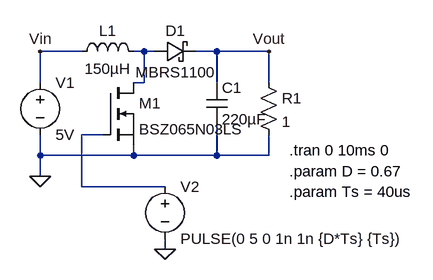
[diagram p0: schematic Boost_Converter.asc]
Boost_Converter.asc, the LTspice schematic file:
Version 4
SHEET 1 880 680
WIRE 176 48 112 48
WIRE 272 48 256 48
WIRE 288 48 272 48
WIRE 384 48 352 48
WIRE 464 48 384 48
WIRE 112 96 112 48
WIRE 272 96 272 48
WIRE 272 96 256 96
WIRE 384 96 384 48
WIRE 464 96 464 48
WIRE 208 176 176 176
WIRE 112 208 112 176
WIRE 256 208 256 192
WIRE 256 208 112 208
WIRE 384 208 384 160
WIRE 384 208 256 208
WIRE 464 208 464 176
WIRE 464 208 384 208
WIRE 112 240 112 208
WIRE 176 256 176 176
WIRE 304 256 176 256
WIRE 304 352 304 336
FLAG 112 240 0
FLAG 304 352 0
FLAG 112 48 Vin
FLAG 464 48 Vout
SYMBOL voltage 112 80 R0
WINDOW 123 0 0 Left 0
WINDOW 39 0 0 Left 0
SYMATTR InstName V1
SYMATTR Value 5V
SYMBOL ind 160 64 R270
WINDOW 0 32 56 VTop 2
WINDOW 3 5 56 VBottom 2
SYMATTR InstName L1
SYMATTR Value 150µH
SYMBOL schottky 288 64 R270
WINDOW 0 32 32 VTop 2
WINDOW 3 0 32 VBottom 2
SYMATTR InstName D1
SYMATTR Value MBRS1100
SYMATTR Description Diode
SYMATTR Type diode
SYMBOL cap 368 96 R0
SYMATTR InstName C1
SYMATTR Value 220µF
SYMBOL res 448 80 R0
SYMATTR InstName R1
SYMATTR Value 1
SYMBOL voltage 304 240 R0
WINDOW 123 0 0 Left 0
WINDOW 39 0 0 Left 0
SYMATTR InstName V2
SYMATTR Value PULSE(0 5 0 1n 1n {D*Ts} {Ts})
SYMBOL nmos 208 96 R0
SYMATTR InstName M1
SYMATTR Value BSZ065N03LS
TEXT 496 232 Left 2 !.param D = 0.67
TEXT 496 264 Left 2 !.param Ts = 40us
TEXT 496 200 Left 2 !.tran 0 10ms 0

The netlist it stands for:
* Boost_Converter.asc
V1 Vin 0 5V
L1 Vin N001 150µH
D1 N001 Vout MBRS1100
C1 Vout 0 220µF
R1 Vout 0 1
V2 N002 0 PULSE(0 5 0 1n 1n {D*Ts} {Ts})
M1 N001 N002 0 0 BSZ065N03LS
.model D D
.lib standard.dio
.model NMOS NMOS
.model PMOS PMOS
.lib standard.mos
.param D = 0.67
.param Ts = 40us
.tran 0 10ms 0
.backanno
.end